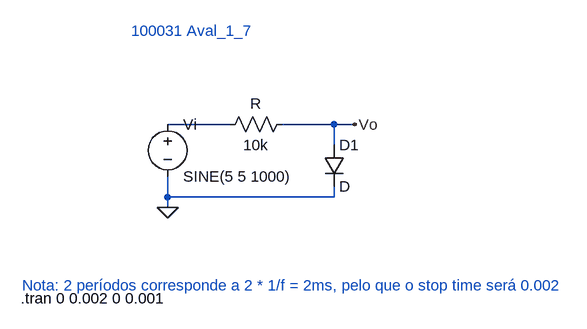
[diagram p0: schematic Aval_1_7.asc]
Aval_1_7.asc, the LTspice schematic file:
Version 4
SHEET 1 880 680
WIRE -224 112 -320 112
WIRE -64 112 -144 112
WIRE -32 112 -64 112
WIRE -64 144 -64 112
WIRE -320 224 -320 192
WIRE -64 224 -64 208
WIRE -64 224 -320 224
WIRE -320 240 -320 224
FLAG -320 240 0
FLAG -32 112 Vo
SYMBOL voltage -320 96 R0
WINDOW 123 0 0 Left 0
WINDOW 39 0 0 Left 0
SYMATTR InstName Vi
SYMATTR Value SINE(5 5 1000)
SYMBOL res -128 96 R90
WINDOW 0 0 56 VBottom 2
WINDOW 3 32 56 VTop 2
SYMATTR InstName R
SYMATTR Value 10k
SYMBOL diode -80 144 R0
SYMATTR InstName D1
TEXT -376 -32 Left 2 ;100031 Aval_1_7
TEXT -544 360 Left 2 ;Nota: 2 períodos corresponde a 2 * 1/f = 2ms, pelo que o stop time será 0.002
TEXT -546 380 Left 2 !.tran 0 0.002 0 0.001

The netlist it stands for:
* Aval_1_7.asc
Vi N001 0 SINE(5 5 1000)
R Vo N001 10k
D1 Vo 0 D
.model D D
.lib standard.dio
* 100031 Aval_1_7
* Nota: 2 períodos corresponde a 2 * 1/f = 2ms, pelo que o stop time será 0.002
.tran 0 0.002 0 0.001
.backanno
.end